# Altium schematic sheet YuanziSTM32.SchDoc
size A2
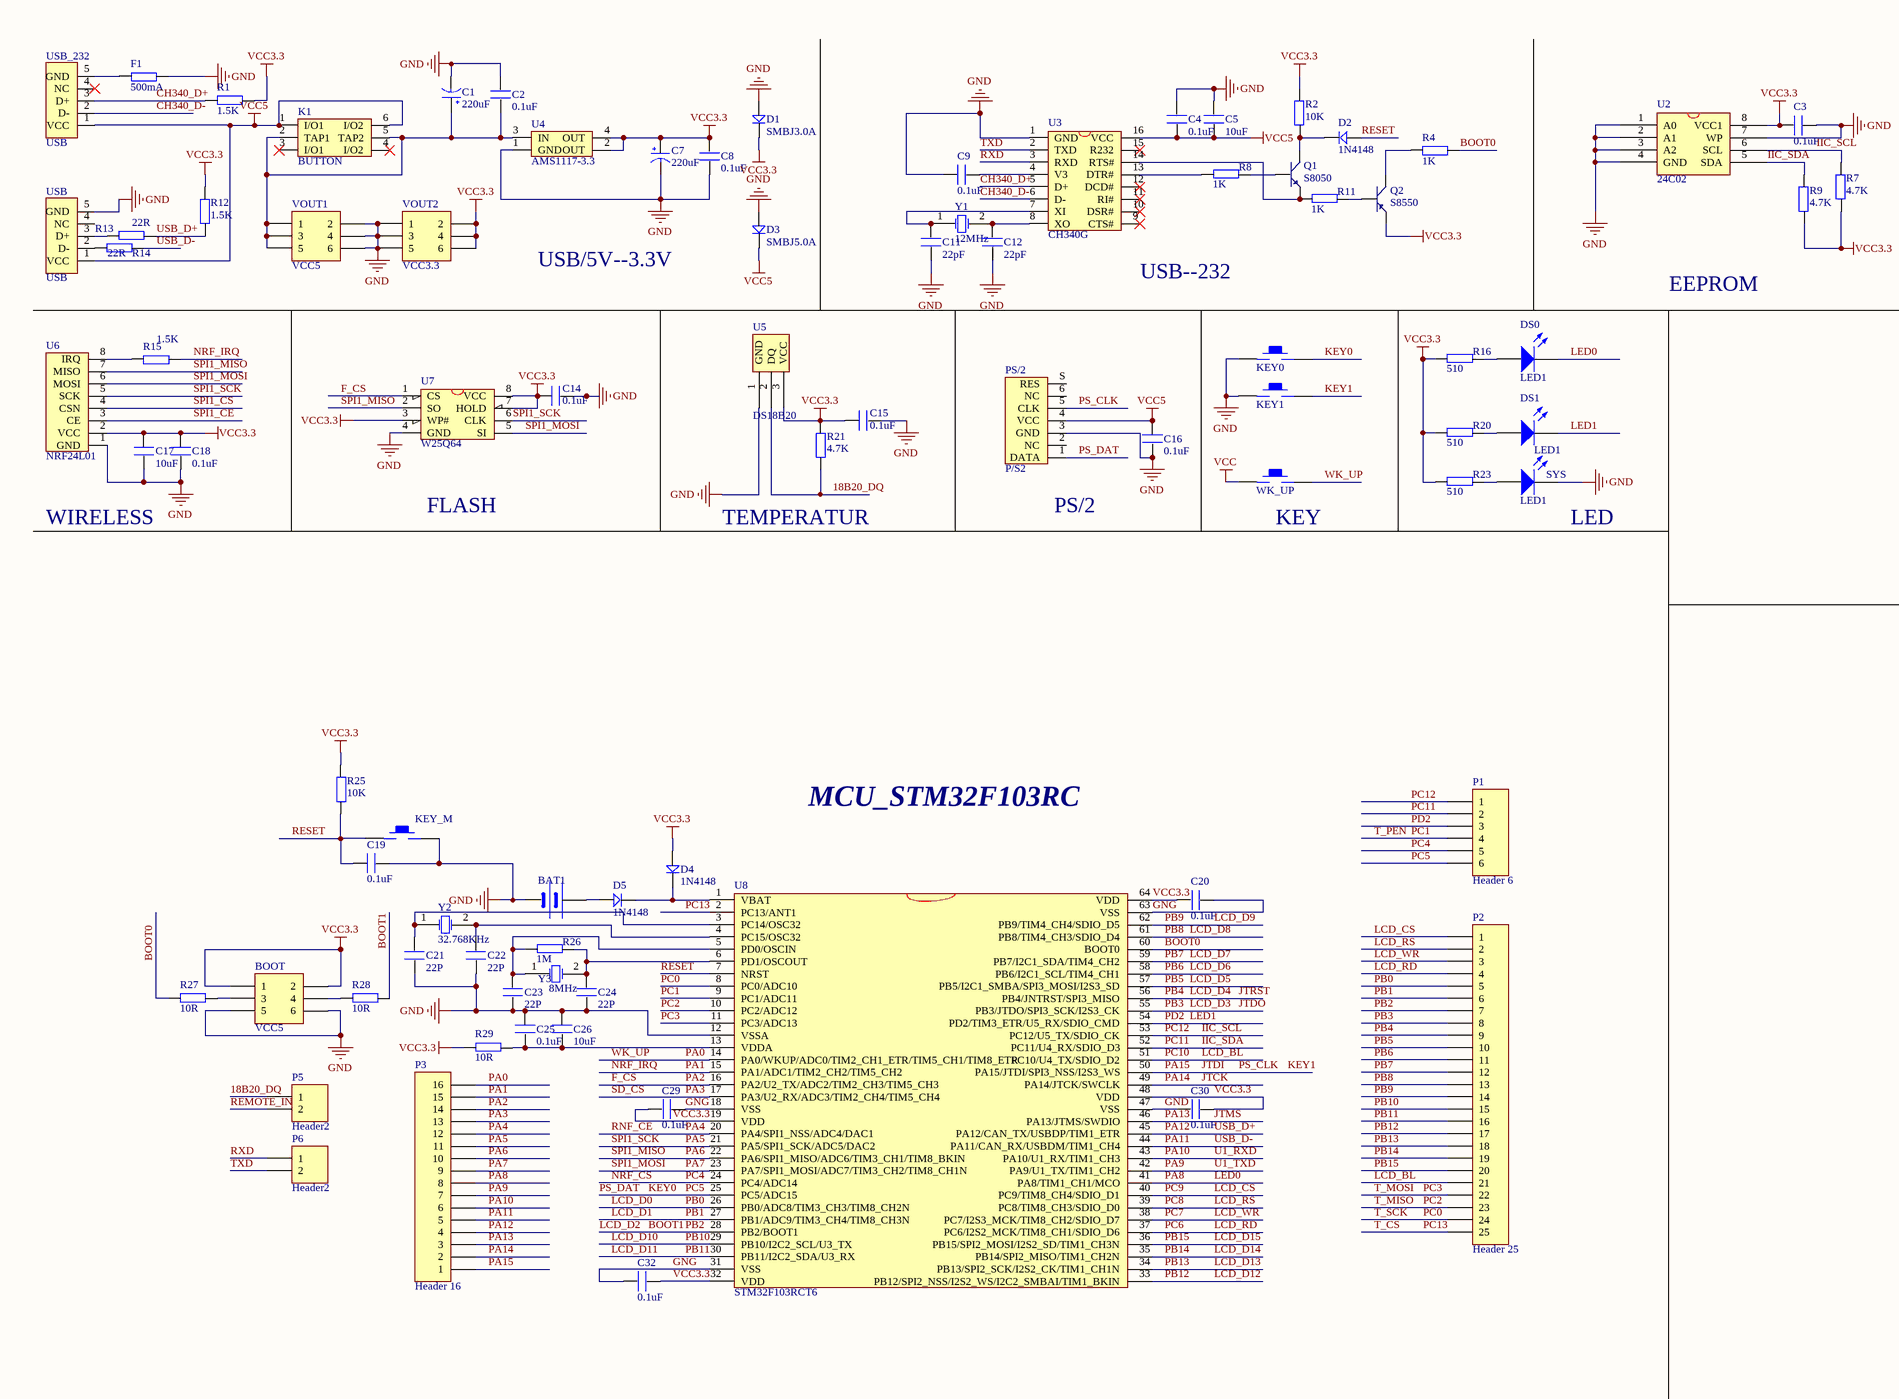
[diagram p0: YuanziSTM32.SchDoc, left]
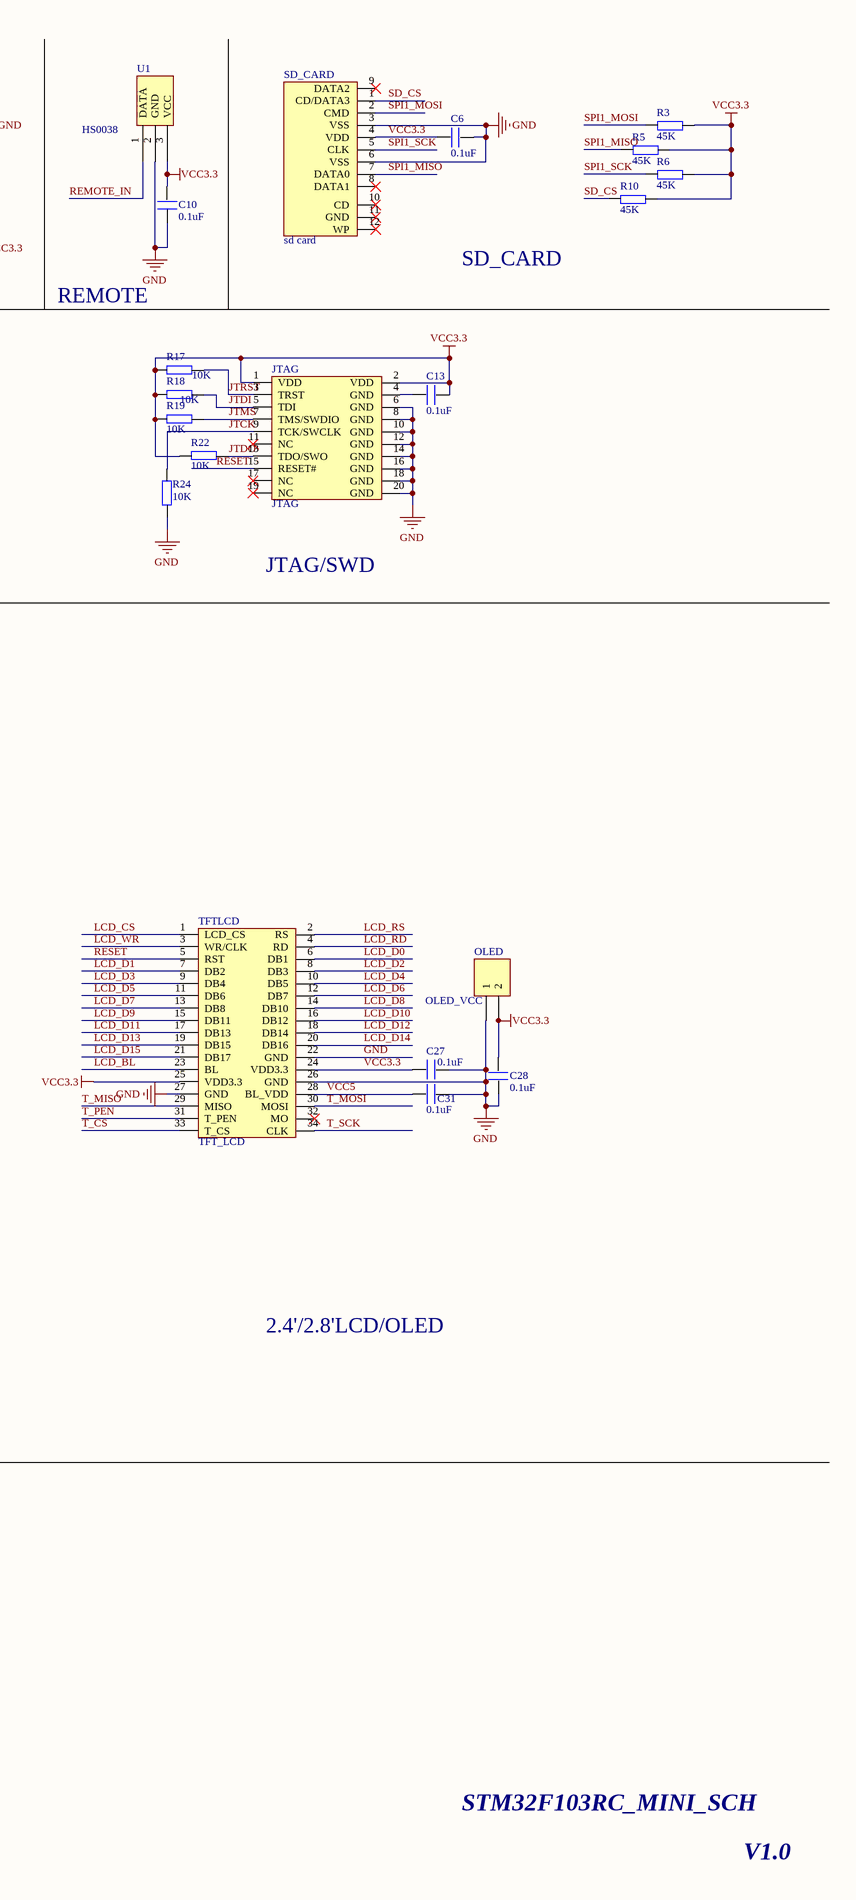
[diagram p1: YuanziSTM32.SchDoc, right]

## Parts
BAT1  BATT  [BATTERY-CELL]  (value not drawn)
BOOT  VCC5  [HDR2X3]
C1  220uF  [CC6.56.5]
C2  0.1uF  [C0603]
C3  0.1uF  [C0603]
C4  0.1uF  [C0603]
C5  10uF  [C0603]
C6  0.1uF  [C0603]
C7  220uF  [CC6.56.5]
C8  0.1uF  [C0603]
C9  0.1uF  [C0603]
C10  0.1uF  [C0603]
C11  22pF  [C0603]
C12  22pF  [C0603]
C13  0.1uF  [C0603]
C14  0.1uF  [C0603]
C15  0.1uF  [C0603]
C16  0.1uF  [C0603]
C17  10uF  [C0603]
C18  0.1uF  [C0603]
C19  0.1uF  [C0603]
C20  0.1uF  [C0603]
C21  22P  [C0603]
C22  22P  [C0603]
C23  22P  [C0603]
C24  22P  [C0603]
C25  0.1uF  [C0603]
C26  10uF  [C0603]
C27  0.1uF  [C0603]
C28  0.1uF  [C0603]
C29  0.1uF  [C0603]
C30  0.1uF  [C0603]
C31  0.1uF  [C0603]
C32  0.1uF  [C0603]
D1  SMBJ3.0A  [DIODE_SOP]
D2  1N4148  [DIODE_SOP]
D3  SMBJ5.0A  [DIODE_SOP]
D4  1N4148  [D0805]
D5  1N4148  [D0805]
DS0  LED1  [SMDLED]
DS1  LED1  [SMDLED]
F1  500mA  [0603P]
JTAG  JTAG  [JTAG_20]
K1  BUTTON  [BTN8.5*8.5]
KEY0  KEY_M  [SW-4PIN-DIP]  (value not drawn)
KEY1  KEY_M  [SW-4PIN-DIP]  (value not drawn)
KEY_M  KEY_M  [SW-4PIN-DIP]  (value not drawn)
OLED  OLED_VCC  [HDR1X2]
P1  Header 6  [HDR1X6]
P2  Header 25  [HDR1X25]
P3  Header 16  [HDR1X16]
P5  Header2  [HDR1X2]
P6  Header2  [HDR1X2]
PS/2  P/S2  [PS2-6PIN]
Q1  S8050  [SOT-23R]
Q2  S8550  [SOT-23R]
R1  1.5K  [R0603]
R2  10K  [R0603]
R3  45K  [R0603]
R4  1K  [R0603]
R5  45K  [R0603]
R6  45K  [R0603]
R7  4.7K  [R0603]
R8  1K  [R0603]
R9  4.7K  [R0603]
R10  45K  [R0603]
R11  1K  [R0603]
R12  1.5K  [R0603]
R13  22R  [R0603]
R14  22R  [R0603]
R15  1.5K  [R0603]
R16  510  [R0603]
R17  10K  [R0603]
R18  10K  [R0603]
R19  10K  [R0603]
R20  510  [R0603]
R21  4.7K  [R0603]
R22  10K  [R0603]
R23  510  [R0603]
R24  10K  [R0603]
R25  10K  [R0603]
R26  1M  [R0603]
R27  10R  [R0603]
R28  10R  [R0603]
R29  10R  [R0603]
SD_CARD  sd card  [SDCARD_L]
SYS  LED1  [SMDLED]
TFTLCD  TFT_LCD  [DB2*17]
U1  HS0038  [HS0038]
U2  24C02  [SOP-8]
U3  CH340G  [SOIC16]
U4  AMS1117-3.3  [AMS1117]
U5  DS18B20  [DS18B20]
U6  NRF24L01  [NRF24L01]
U7  W25Q64  [SOP-8]
U8  STM32F103RCT6  [LQFP64]
USB  USB  [USB/SM0.8-6H5]
USB_232  USB  [USB/SM0.8-6H5]
VOUT1  VCC5  [HDR2X3]
VOUT2  VCC3.3  [HDR2X3]
WK_UP  KEY_M  [SW-4PIN-DIP]  (value not drawn)
Y1  12MHz  [XTAL]
Y2  32.768KHz  [X_32.768KHZ - duplicate]
Y3  8MHz  [XTAL]

## Nets
GND: BAT1.2(GND) BOOT.5 BOOT.6 C1.2(GND) C2.2 C3.1 C4.2 C5.2 C6.2 C7.2(GND) C8.2 C9.1 C10.2 C11.1 C12.1 C14.2 C15.2 C16.1 C17.1 C18.1 C19.2 C21.1 C22.1 C23.1 C24.1 C25.2 C26.2 C27.1 C28.2 C30.2 C31.1 D1.1 D3.1 F1.2 JTAG.6(GND) JTAG.8(GND) JTAG.10(GND) JTAG.12(GND) JTAG.14(GND) JTAG.16(GND) JTAG.18(GND) JTAG.20(GND) KEY0.1 KEY1.1 KEY_M.2 OLED.1 PS/2.3(GND) R24.2 SD_CARD.3(VSS) SD_CARD.6(VSS) SYS.2(K) TFTLCD.22(GND) TFTLCD.26(GND) TFTLCD.27(GND) U1.2(GND) U2.1(A0) U2.2(A1) U2.3(A2) U2.4(GND) U2.7(WP) U3.1(GND) U4.1(GND) U5.1(GND) U6.1(GND) U7.4(GND) U8.12(VSSA) U8.47(VSS) USB_232.5(GND) VOUT1.2 VOUT1.4 VOUT1.6 VOUT2.1 VOUT2.3 VOUT2.5
VCC: WK_UP.1
VCC3.3: BOOT.1 BOOT.2 C3.2 C6.1 C7.1(VCC) C8.1 C10.1 C13.1 C14.1 C15.1 C17.2 C18.2 C20.2 C27.2 C28.1 C29.2 C30.1 C32.1 D1.2 D4.1 JTAG.1(VDD) JTAG.2(VDD) OLED.2 Q2.1(E) R1.1 R2.1 R3.2 R5.2 R6.2 R7.2 R9.2 R10.2 R12.1 R16.2 R17.2 R18.2 R19.2 R20.2 R21.2 R22.2 R23.2 R25.2 R29.2 SD_CARD.4(VDD) TFTLCD.24(VDD3.3) TFTLCD.25(VDD3.3) U1.3(VCC) U2.8(VCC1) U4.2(OUT) U4.4(OUT) U5.3(VCC) U6.2(VCC) U7.3(WP#) U7.7(HOLD) U7.8(VCC) U8.19(VDD) U8.32(VDD) U8.48(VDD) U8.64(VDD) VOUT2.2 VOUT2.4 VOUT2.6
VCC5: C4.1 C5.1 C16.2 C31.2 D3.2 K1.1(I/O1) K1.6(I/O2) PS/2.4(VCC) TFTLCD.28(BL_VDD) U3.16(VCC) USB.1(VCC) USB_232.1(VCC)
18B20_DQ: P5.1 R21.1 U5.2(DQ)
BOOT0: R4.2 R27.2 U8.60(BOOT0)
BOOT1: P2.7 R28.1 TFTLCD.8(DB3) U8.28(PB2/BOOT1)  [also labelled LCD_D2, PB2]
CH340_D+: R1.2 U3.5(D+) USB.3(D+)
CH340_D-: U3.6(D-) USB.2(D-)
F_CS: P3.14 U7.1(CS) U8.16(PA2/U2_TX/ADC2/TIM2_CH3/TIM5_CH3)  [also labelled PA2]
GNG: C20.1 C29.1 C32.2 U8.18(VSS) U8.31(VSS) U8.63(VSS)
IIC_SCL: P1.1 R7.1 U2.6(SCL) U8.53(PC12/U5_TX/SDIO_CK)  [also labelled PC12]
IIC_SDA: P1.2 R9.1 U2.5(SDA) U8.52(PC11/U4_RX/SDIO_D3)  [also labelled PC11]
JTCK: JTAG.9(TCK/SWCLK) P3.2 R24.1 U8.49(PA14/JTCK/SWCLK)  [also labelled PA14]
JTDI: JTAG.5(TDI) KEY1.2 P3.1 PS/2.5(CLK) R18.1 U8.50(PA15/JTDI/SPI3_NSS/I2S3_WS)  [also labelled KEY1, PA15, PS_CLK]
JTDO: JTAG.13(TDO/SWO) P2.8 R22.1 TFTLCD.9(DB4) U8.55(PB3/JTDO/SPI3_SCK/I2S3_CK)  [also labelled LCD_D3, PB3]
JTMS: JTAG.7(TMS/SWDIO) P3.3 R19.1 U8.46(PA13/JTMS/SWDIO)  [also labelled PA13]
JTRST: JTAG.3(TRST) P2.9 R17.1 TFTLCD.10(DB5) U8.56(PB4/JNTRST/SPI3_MISO)  [also labelled LCD_D4, PB4]
KEY0: KEY0.2 P1.6 PS/2.1(DATA) U8.25(PC5/ADC15)  [also labelled PC5, PS_DAT]
LCD_BL: P2.21 TFTLCD.23(BL) U8.51(PC10/U4_TX/SDIO_D2)  [also labelled PC10]
LCD_CS: P2.1 TFTLCD.1(LCD_CS) U8.40(PC9/TIM8_CH4/SDIO_D1)  [also labelled PC9]
LCD_D0: P2.5 TFTLCD.6(DB1) U8.26(PB0/ADC8/TIM3_CH3/TIM8_CH2N)  [also labelled PB0]
LCD_D1: P2.6 TFTLCD.7(DB2) U8.27(PB1/ADC9/TIM3_CH4/TIM8_CH3N)  [also labelled PB1]
LCD_D5: P2.10 TFTLCD.11(DB6) U8.57(PB5/I2C1_SMBA/SPI3_MOSI/I2S3_SD)  [also labelled PB5]
LCD_D6: P2.11 TFTLCD.12(DB7) U8.58(PB6/I2C1_SCL/TIM4_CH1)  [also labelled PB6]
LCD_D7: P2.12 TFTLCD.13(DB8) U8.59(PB7/I2C1_SDA/TIM4_CH2)  [also labelled PB7]
LCD_D8: P2.13 TFTLCD.14(DB10) U8.61(PB8/TIM4_CH3/SDIO_D4)  [also labelled PB8]
LCD_D9: P2.14 TFTLCD.15(DB11) U8.62(PB9/TIM4_CH4/SDIO_D5)  [also labelled PB9]
LCD_D10: P2.15 TFTLCD.16(DB12) U8.29(PB10/I2C2_SCL/U3_TX)  [also labelled PB10]
LCD_D11: P2.16 TFTLCD.17(DB13) U8.30(PB11/I2C2_SDA/U3_RX)  [also labelled PB11]
LCD_D12: P2.17 TFTLCD.18(DB14) U8.33(PB12/SPI2_NSS/I2S2_WS/I2C2_SMBAI/TIM1_BKIN)  [also labelled PB12]
LCD_D13: P2.18 TFTLCD.19(DB15) U8.34(PB13/SPI2_SCK/I2S2_CK/TIM1_CH1N)  [also labelled PB13]
LCD_D14: P2.19 TFTLCD.20(DB16) U8.35(PB14/SPI2_MISO/TIM1_CH2N)  [also labelled PB14]
LCD_D15: P2.20 TFTLCD.21(DB17) U8.36(PB15/SPI2_MOSI/I2S2_SD/TIM1_CH3N)  [also labelled PB15]
LCD_RD: P2.4 TFTLCD.4(RD) U8.37(PC6/I2S2_MCK/TIM8_CH1/SDIO_D6)  [also labelled PC6]
LCD_RS: P2.2 TFTLCD.2(RS) U8.39(PC8/TIM8_CH3/SDIO_D0)  [also labelled PC8]
LCD_WR: P2.3 TFTLCD.3(WR/CLK) U8.38(PC7/I2S3_MCK/TIM8_CH2/SDIO_D7)  [also labelled PC7]
LED0: DS0.2(K) P3.8 U8.41(PA8/TIM1_CH1/MCO)  [also labelled PA8]
LED1: DS1.2(K) P1.3 U8.54(PD2/TIM3_ETR/U5_RX/SDIO_CMD)  [also labelled PD2]
NRF_CS: P1.5 U8.24(PC4/ADC14)  [also labelled PC4]
NRF_IRQ: P3.15 R15.2 U8.15(PA1/ADC1/TIM2_CH2/TIM5_CH2)  [also labelled PA1]
PA0: P3.16 U8.14(PA0/WKUP/ADC0/TIM2_CH1_ETR/TIM5_CH1/TIM8_ETR) WK_UP.2  [also labelled WK_UP]
PA3: P3.13 R10.1 SD_CARD.1(CD/DATA3) U8.17(PA3/U2_RX/ADC3/TIM2_CH4/TIM5_CH4)  [also labelled SD_CS]
PA4: P3.12 U8.20(PA4/SPI1_NSS/ADC4/DAC1)  [also labelled RNF_CE]
PA5: P3.11 R6.1 SD_CARD.5(CLK) U6.5(SCK) U7.6(CLK) U8.21(PA5/SPI1_SCK/ADC5/DAC2)  [also labelled SPI1_SCK]
PA6: P3.10 R5.1 SD_CARD.7(DATA0) U6.7(MISO) U7.2(SO) U8.22(PA6/SPI1_MISO/ADC6/TIM3_CH1/TIM8_BKIN)  [also labelled SPI1_MISO]
PA7: P3.9 R3.1 SD_CARD.2(CMD) U6.6(MOSI) U7.5(SI) U8.23(PA7/SPI1_MOSI/ADC7/TIM3_CH2/TIM8_CH1N)  [also labelled SPI1_MOSI]
PA9: P3.7 U8.42(PA9/U1_TX/TIM1_CH2)  [also labelled U1_TXD]
PA10: P3.6 U8.43(PA10/U1_RX/TIM1_CH3)  [also labelled U1_RXD]
PA11: P3.5 R14.1 U8.44(PA11/CAN_RX/USBDM/TIM1_CH4)  [also labelled USB_D-]
PA12: P3.4 R12.2 R13.1 U8.45(PA12/CAN_TX/USBDP/TIM1_ETR)  [also labelled USB_D+]
PC0: P2.24 TFTLCD.34(CLK) U8.8(PC0/ADC10)  [also labelled T_SCK]
PC1: P1.4 TFTLCD.31(T_PEN) U8.9(PC1/ADC11)  [also labelled T_PEN]
PC2: P2.23 TFTLCD.29(MISO) U8.10(PC2/ADC12)  [also labelled T_MISO]
PC3: P2.22 TFTLCD.30(MOSI) U8.11(PC3/ADC13)  [also labelled T_MOSI]
PC13: P2.25 TFTLCD.33(T_CS) U8.2(PC13/ANT1)  [also labelled T_CS]
REMOTE_IN: P5.2 U1.1(DATA)
RESET: C19.1 D2.1 JTAG.15(RESET#) KEY_M.1 R25.1 TFTLCD.5(RST) U8.7(NRST)
RXD: P6.1 U3.3(RXD)
SPI1_CE: U6.3(CE)
SPI1_CS: U6.4(CSN)
TXD: P6.2 U3.2(TXD)
NetBAT1_1: BAT1.1(VCC) D5.1
NetBOOT_3: BOOT.3 R27.1
NetBOOT_4: BOOT.4 R28.2
NetC1_1: C1.1(VCC) C2.1 K1.2(TAP1) K1.5(TAP2) U4.3(IN) VOUT1.1 VOUT1.3 VOUT1.5
NetC9_2: C9.2 U3.4(V3)
NetC11_2: C11.2 U3.7(XI) Y1.1(OSC1)
NetC12_2: C12.2 U3.8(XO) Y1.2(OSC2)
NetC13_2: C13.2 JTAG.4(GND)
NetC21_2: C21.2 U8.3(PC14/OSC32) Y2.1(OSC1)
NetC22_2: C22.2 U8.4(PC15/OSC32) Y2.2(OSC2)
NetC23_2: C23.2 R26.2 U8.5(PD0/OSCIN) Y3.1(OSC1)
NetC24_2: C24.2 R26.1 U8.6(PD1/OSCOUT) Y3.2(OSC2)
NetC25_1: C25.1 C26.1 R29.1 U8.13(VDDA)
NetD2_2: D2.2 Q1.3(C) R2.2
NetD4_2: D4.2 D5.2 U8.1(VBAT)
NetDS0_1: DS0.1(A) R16.1
NetDS1_1: DS1.1(A) R20.1
NetF1_1: F1.1 USB.5(GND)
NetQ1_1: Q1.1(E) R11.2 U3.14(RTS#)
NetQ1_2: Q1.2(B) R8.1
NetQ2_2: Q2.2(B) R11.1
NetQ2_3: Q2.3(C) R4.1
NetR8_2: R8.2 U3.13(DTR#)
NetR13_2: R13.2 USB_232.3(D+)
NetR14_2: R14.2 USB_232.2(D-)
NetR15_1: R15.1 U6.8(IRQ)
NetR23_1: R23.1 SYS.1(A)

Not connected (* = marked no-connect by the designer): JTAG 11(NC)* 17(NC)* 19(NC)*; K1 3(I/O1)* 4(I/O2)*; PS/2 2(NC) 6(NC) S(RES); SD_CARD 8(DATA1)* 9(DATA2)* 10(CD)* 11(GND)* 12(WP)*; TFTLCD 32(MO)*; U3 9(CTS#)* 10(DSR#)* 11(RI#)* 12(DCD#)* 15(R232)*; USB 4(NC)*; USB_232 4(NC)

## Notes on the sheet
- USB/5V--3.3V
- (near U3) USB--232
- EEPROM
- SD_CARD
- REMOTE
- WIRELESS
- FLASH
- TEMPERATUR
- (near PS/2) PS/2
- (near WK_UP) KEY
- (near SYS) LED
- JTAG/SWD
- MCU_STM32F103RC
- 2.4'/2.8'LCD/OLED
- STM32F103RC_MINI_SCH
- V1.0

## Library data of the parts
BAT1 = BAT
BOOT VOUT1 VOUT2 = Header 3X2: Header, 3-Pin, Dual row; LatestRevisionDate: 17-Jul-2002; LatestRevisionNote: Re-released for DXP Platform.; Publisher: Altium Limited
C1 C7 = CAP
C2-C6 C8-C32 = C
D1 D3 = D: 1N4148
D2 D4 D5 = D
DS0 DS1 SYS = LED2: Typical RED, GREEN, YELLOW, AMBER GaAs LED; Published: 8-Jun-2000; LatestRevisionDate: 17-Jul-2002; LatestRevisionNote: Re-released for DXP Platform.; PackageDocument: Feb-2002; PackageReference: 3.2X1.6X1.1; Publisher: Altium Limited
F1 R1-R29 = R
OLED P5 P6 = Header 2: Header, 2-Pin; LatestRevisionDate: 17-Jul-2002; LatestRevisionNote: Re-released for DXP Platform.; Publisher: Altium Limited
P1 = Header 6: Header, 6-Pin; LatestRevisionDate: 17-Jul-2002; LatestRevisionNote: Re-released for DXP Platform.; Publisher: Altium Limited
P2 = Header 25: Header, 25-Pin; LatestRevisionDate: 17-Jul-2002; LatestRevisionNote: Re-released for DXP Platform.; Publisher: Altium Limited
P3 = Header 16: Header, 16-Pin; LatestRevisionDate: 17-Jul-2002; LatestRevisionNote: Re-released for DXP Platform.; Publisher: Altium Limited
Q1 = NPN: 8050/BCW846/BCW847
Q2 = PNP: 8550/BCW68
U2 = 24C256
U3 = CH340G: USB2UART
U4 = AMS1117
U7 = W25X16: W25X16;SST25VF016;MX25L1605
U8 = STM32F103RDT6
USB USB_232 = USB5
Y1-Y3 = XTAL: Crystal Oscillator; Published: 8-Jun-2000; LatestRevisionDate: 17-Jul-2002; LatestRevisionNote: Re-released for DXP Platform.; Publisher: Altium Limited